# EAGLE design AST1028 (EAGLE 6.3)
DATABASE: ./../../../../../Components/TinyCircuits_Part_Database.txt
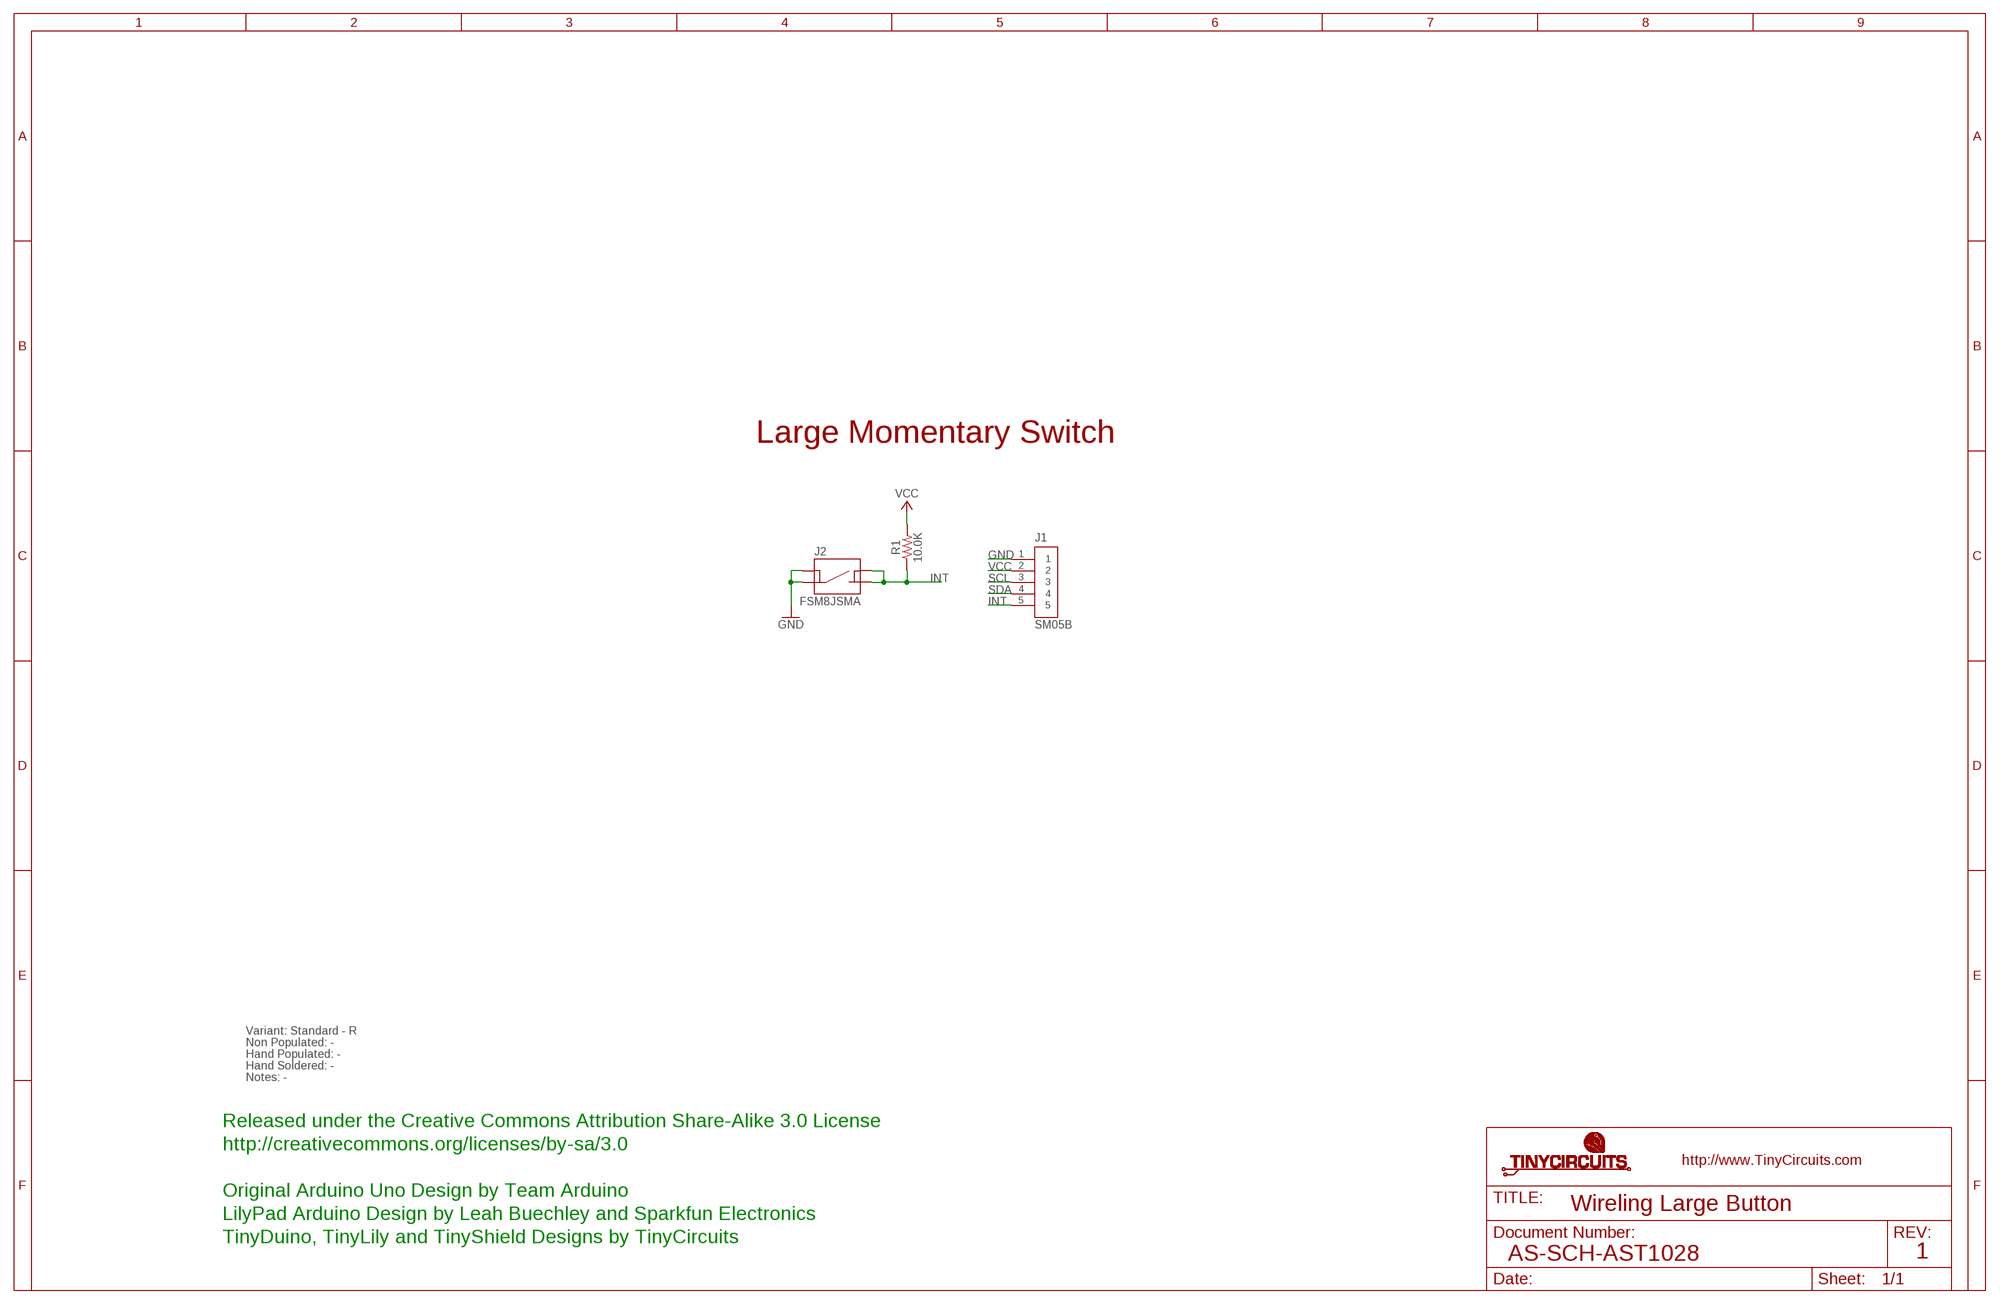
[diagram p0: schematic, sheet 1]

## Parts
J1  SM05B  AS-ITM-00340EDGE  [JST_SH_5X1_EDGE]
J2  FSM8JSMA  AS-ITM-00278  [SWITCH-FSM/JSM]
R1  10.0K  AS-ITM-00032  [0402]

## Nets
GND: J1.1 J2.P$1 J2.P$4
INT: J1.5 J2.P$2 J2.P$3 R1.1
SCL: J1.3
SDA: J1.4
VCC: J1.2 R1.2

## Notes on the sheet
- Large Momentary Switch
- Variant: Standard - R
- Non Populated: -
- Hand Populated: -
- Hand Soldered: -
- Notes: -
- Released under the Creative Commons Attribution Share-Alike 3.0 License
- http://creativecommons.org/licenses/by-sa/3.0
- Original Arduino Uno Design by Team Arduino
- Wireling Large Button
- LilyPad Arduino Design by Leah Buechley and Sparkfun Electronics
- TinyDuino, TinyLily and TinyShield Designs by TinyCircuits
- AS-SCH-AST1028 | 1

## Library data of the parts
J1 = tinycircuits:AS-ITM-00340: CONN HEADER SH 5POS SIDE 1MM TIN; PARTNO: AS-ITM-00340; PNPROTATION: 180
J2 = tinycircuits:AS-ITM-00278: SWITCH TACTILE SPST-NO 0.05A 24V; PARTNO: AS-ITM-00278
R1 = tinycircuits:AS-ITM-00032: RES 10.0K OHM 1/16W 1% 0402 SMD; PARTNO: AS-ITM-00032

## Net classes
2 gnd: width 0.305 mm, drill 0.559 mm, clearance 0.254 mm

## Board
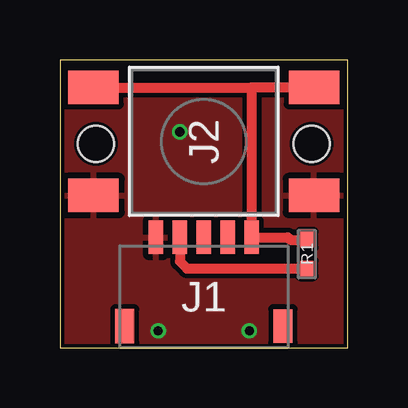
[diagram p1: board, top side]
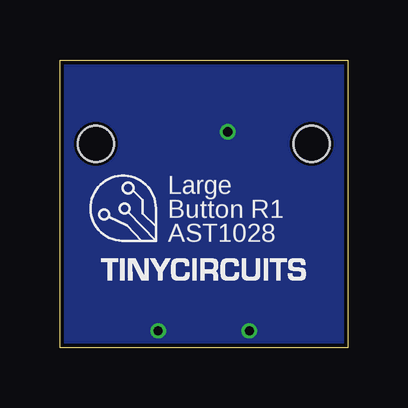
[diagram p2: board, bottom side, seen from below]

Size 12 x 12 mm. Coordinates in mm from the lower left corner, seen from the top.
Outline: 0,0 12,0 12,12 0,12 0,0
Copper layers (1*16): Top 0.035mm / dielectric 1.5mm / Bottom 0.035mm
Design rules "default *": minimum track width 8mil, minimum drill 15mil, track to track 8mil, track to pad 8mil, pad to pad 8mil, via to via 8mil, smd to smd 8mil, copper to edge 6mil, drill to drill 8mil, minimum pad ring 8mil, minimum via ring 5mil, stop-mask expansion 4mil, vias tented up to drill 25mil, thermal gap 10mil
Holes 1.5 mm at 1.5,8.5 10.5,8.5

### Footprints (pad centres in the part's own frame; a part is rotated, then mirrored left to right if it is on the bottom)
JST_SH_5X1_EDGE = smd 0.6 x 1.4: 1 -2,2.475; 2 -1,2.475; 3 0,2.475; 4 1,2.475; 5 2,2.475 | smd 0.8 x 1.4: PAD1 -3.3,-1.225; PAD2 3.3,-1.225
SWITCH-FSM/JSM = smd 1.4 x 2.1: P$1 -2.25,4.6; P$2 2.25,4.6; P$3 2.25,-4.6; P$4 -2.25,-4.6
0402 = smd 0.65 x 0.55: 1 -0.6,0; 2 0.6,0

### Placement (x,y rotation side)
J1  6,2.12 0 top
J2  6,8.6 90 top
R1  10.3,3.9 270 top
U$1  [DOCFIELD-TINYCIRCUITS-PCB]  20,-10 0 top  (outside the outline)

### Tracks (layer width: path | path; a pad name or v marks a point on that pad's centre or on a via)
GND  (via drill 0.38)
  other vias: 4.1,0.7 7.9,0.7 5,9
  pour Bottom: 0,12 12,12 12,0 0,0
  pour Top: 0,12 12,12 12,0 0,0
INT
  Top 0.406: J1.5 7.98,4.6 | 8,4.5 J1.5 | J2.P$2 7.98,10.85 8,10.85 | J2.P$3 8,10.85 | J1.5 9.5,4.6 9.6,4.5 R1.1 | J1.5 8,10.85
VCC
  Top 0.406: J1.2 5,3.6 5.3,3.3 R1.2

### Text on the board
bPlace: Large | Button R1 | AST1028
Document: FABRICATION DRAWING | NOTES: | 1. PRINTED CIRCUIT BOARD MADE FROM NEMA GRADE FR-4 EPOXY LAMINATE | WITH 1 OUNCE COPPER PLATING AND .024 THICKNESS. | 2. ALL DIMENSIONS ARE GIVEN IN MILLIMETERS. | 3. CIRCUIT PATHS ARE FOR REFERENCE ONLY. | 4. HOLE SIZES SHOWN ARE FINISHED DIAMETERS AFTER PLATING. | 5. BOARD PLATED USING REFLOW OR SIMILAR METHOD. | 6. BOARD TO HAVE BLUE SOLDER MASK ON PLATED SURFACES USING WET FILM | 7. SILKSCREEN BOARD USING WHITE INK. | SR100 OR SR1010 EPOXY. EQUIVALENT WET OR DRY FILM MAY BE USED. | 8. THE FOLLOWING INFORMATION APPLIES TO THIS BOARD: | * 2 COPPER LAYERS | * .024 BOARD THICKNESS | * REQUIRES TOP SIDE SILKSCREEN | Released under the Creative Commons Attribution Share-Alike 3.0 License | http://creativecommons.org/licenses/by-sa/3.0 | Original Arduino Uno Design by Team Arduino | LilyPad Arduino Design by Leah Buechley and Sparkfun Electronics | TinyDuino, TinyLily and TinyShield Designs by TinyCircuits | Wireling Large Button | AS-PCB-AST1028 | 1